# EAGLE schematic m-power-v0 (EAGLE 5.07)
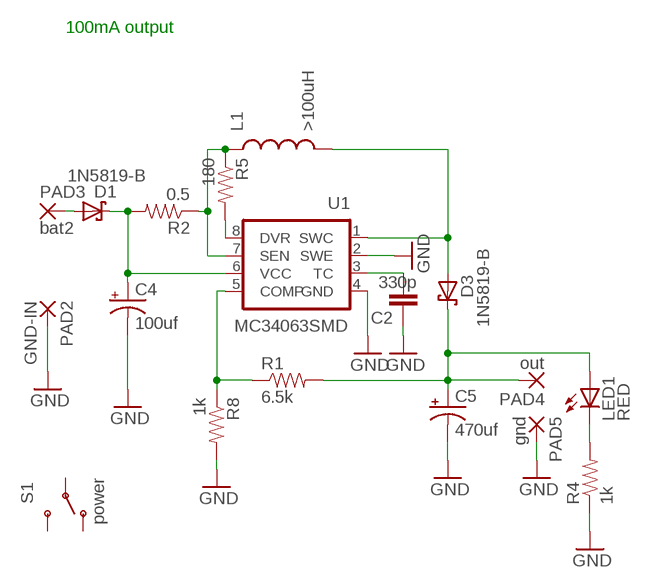
[diagram p0: schematic, sheet 1]

## Parts
C2  330p  CAP0805  [0805]
C4  100uf  CAP_POL1206  [EIA3216]
C5  470uf  CAP_POL1206  [EIA3216]
D1  1N5819-B  [DO41-7.6]
D3  1N5819-B  [DO41-7.6]
L1  >100uH  INDUCTORCR54  [CR54]
LED1  RED  LED0805  [CHIPLED_0805]
PAD2  GND-IN  3,17/1,1  [3,17/1,1]
PAD3  bat2  3,17/1,1  [3,17/1,1]
PAD4  out  3,17/1,1  [3,17/1,1]
PAD5  gnd  3,17/1,1  [3,17/1,1]
R1  6.5k  RESISTOR0805  [0805]
R2  0.5  RESISTOR2010  [R2010]
R4  1k  RESISTOR0805  [0805]
R5  180  RESISTOR0805  [0805]
R8  1k  RESISTOR0805  [0805]
S1  power  SWITCH-SPST3AM6  [SWITCH-SPDT-AM#6]
U1  MC34063SMD  [SO08]

## Nets
GND: C2.1 C4.C(-) C5.C(-) PAD2.1(P) PAD5.1(P) R4.1 R8.2 U1.2(SWE) U1.4(GND)
N$1: C2.2 U1.3(TC)
N$2: C4.A(+) D1.C R2.2 U1.6(VCC)
N$3: R1.1 R8.1 U1.5(COMP)
N$4: C5.A(+) D3.C LED1.A PAD4.1(P) R1.2
N$5: LED1.C R4.2
N$6: R5.2 U1.8(DVR)
N$8: L1.P$1 R2.1 R5.1 U1.7(SEN)
N$9: D1.A PAD3.1(P)
N$10: D3.A L1.P$2 U1.1(SWC)
Unconnected: S1.1(O) S1.2(P) S1.3(S)

## Notes on the sheet
- 100mA output

## Library data of the parts
C2 = SparkFun:CAP: Capacitor Standard 0603 ceramic capacitor, and 0.1" leaded capacitor.
C4 C5 = SparkFun:CAP_POL: Capacitor Polarized These are standard SMD and PTH capacitors. Normally 10uF, 47uF, and 100uF in electrolytic and tantalum varieties. Always verify the external diameter of the through hole cap, it varies with capacity, voltage, and manufacturer. The EIA devices should be standard.
D1 D3 = digital-toy:1N581*: 1.0A SCHOTTKY BARRIER RECTIFIER Source: http://www.diodes.com/datasheets/ds23001.pdf
L1 = SparkFun:INDUCTOR: Inductors Basic Inductor/Choke - 0603 and 1206. Footprints are not proven and vary greatly between part numbers.
LED1 = digital-toy:LED: LEDs Standard schematic elements and footprints for 5mm, 3mm, 1206, and 0603 sized LEDs. 5mm - Spark Fun Electronics SKU : COM-00529 (and others) copy led.lbr 0805 led here, by hyl digital-toy. 2010.6.29
PAD2-PAD5 = wirepad:3,17/1,1: THROUGH-HOLE PAD
R1 R2 R4 R5 R8 = digital-toy:RESISTOR: Resistor Basic schematic elements and footprints for 0603, 1206, and PTH 1/10th watt (small) resistors. digital-toy copy vertical mount of axial-0.3 from rcl.lbr : the 0207/xx
S1 = digital-toy:SWITCH-SPST: SPST Switch Simple slide switch. Spark Fun Electronics SKU : COM-00102
U1 = digital-toy:MC34063: digital toy dip8-l smd